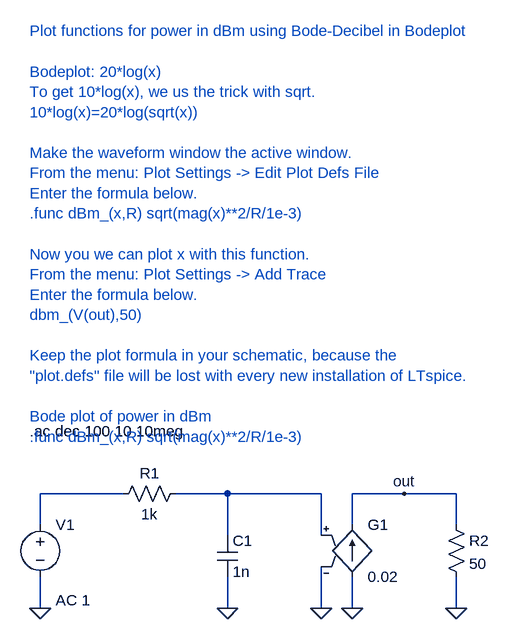
[diagram p0: schematic ac_math2.asc]
ac_math2.asc, the LTspice schematic file:
Version 4
SHEET 1 880 680
WIRE 128 160 0 160
WIRE 288 160 208 160
WIRE 432 160 288 160
WIRE 560 160 480 160
WIRE 640 160 560 160
WIRE 0 208 0 160
WIRE 480 208 480 160
WIRE 640 208 640 160
WIRE 288 224 288 160
WIRE 432 224 432 160
WIRE 0 336 0 288
WIRE 288 336 288 288
WIRE 432 336 432 272
WIRE 480 336 480 288
WIRE 640 336 640 288
FLAG 0 336 0
FLAG 288 336 0
FLAG 432 336 0
FLAG 480 336 0
FLAG 640 336 0
FLAG 560 160 out
SYMBOL res 112 176 R270
WINDOW 0 32 56 VTop 0
WINDOW 3 0 56 VBottom 0
SYMATTR InstName R1
SYMATTR Value 1k
SYMBOL cap 272 224 R0
SYMATTR InstName C1
SYMATTR Value 1n
SYMBOL voltage 0 192 R0
WINDOW 123 24 132 Left 0
WINDOW 39 0 0 Left 0
SYMATTR Value2 AC 1
SYMATTR InstName V1
SYMATTR Value ""
SYMBOL res 624 192 R0
SYMATTR InstName R2
SYMATTR Value 50
SYMBOL g 480 192 R0
SYMATTR InstName G1
SYMATTR Value 0.02
TEXT -16 64 Left 0 !.ac dec 100 10 10meg
TEXT -16 -552 Left 0 ;Plot functions for power in dBm using Bode-Decibel in Bodeplot\n \nBodeplot: 20*log(x)\nTo get 10*log(x), we us the trick with sqrt.\n10*log(x)=20*log(sqrt(x))\n \nMake the waveform window the active window. \nFrom the menu: Plot Settings -> Edit Plot Defs File\nEnter the formula below.\n.func dBm_(x,R) sqrt(mag(x)**2/R/1e-3)\n \nNow you we can plot x with this function.\nFrom the menu: Plot Settings -> Add Trace\nEnter the formula below.\ndbm_(V(out),50)\n \nKeep the plot formula in your schematic, because the \n"plot.defs" file will be lost with every new installation of LTspice.\n \nBode plot of power in dBm\n.func dBm_(x,R) sqrt(mag(x)**2/R/1e-3)

The netlist it stands for:
* ac_math2.asc
R1 N001 N002 1k
C1 N002 0 1n
V1 N001 0 AC 1
R2 out 0 50
G1 0 out N002 0 0.02
.ac dec 100 10 10meg
* Plot functions for power in dBm using Bode-Decibel in Bodeplot
* Bodeplot: 20*log(x)
* To get 10*log(x), we us the trick with sqrt.
* 10*log(x)=20*log(sqrt(x))
* Make the waveform window the active window.
* From the menu: Plot Settings -> Edit Plot Defs File
* Enter the formula below.
* .func dBm_(x,R) sqrt(mag(x)**2/R/1e-3)
* Now you we can plot x with this function.
* From the menu: Plot Settings -> Add Trace
* Enter the formula below.
* dbm_(V(out),50)
* Keep the plot formula in your schematic, because the
* "plot.defs" file will be lost with every new installation of LTspice.
* Bode plot of power in dBm
* .func dBm_(x,R) sqrt(mag(x)**2/R/1e-3)
.backanno
.end